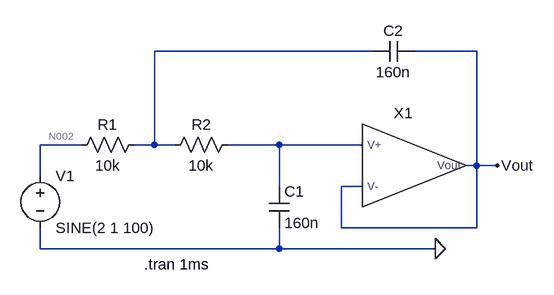
[diagram p0: schematic SecondOrder2.asc]
SecondOrder2.asc, the LTspice schematic file:
Version 4
SHEET 1 880 680
WIRE 224 -224 -112 -224
WIRE 384 -224 288 -224
WIRE -224 -80 -288 -80
WIRE -112 -80 -112 -224
WIRE -112 -80 -144 -80
WIRE -80 -80 -112 -80
WIRE 80 -80 0 -80
WIRE 208 -80 80 -80
WIRE 384 -48 384 -224
WIRE 384 -48 368 -48
WIRE 416 -48 384 -48
WIRE -288 -32 -288 -80
WIRE 80 -16 80 -80
WIRE 208 -16 176 -16
WIRE 176 48 176 -16
WIRE 384 48 384 -48
WIRE 384 48 176 48
WIRE -288 80 -288 48
WIRE 80 80 80 48
WIRE 80 80 -288 80
WIRE 320 80 80 80
FLAG 320 80 0
FLAG 416 -48 Vout
SYMBOL res -128 -96 R90
WINDOW 0 0 56 VBottom 2
WINDOW 3 32 56 VTop 2
SYMATTR InstName R1
SYMATTR Value 10k
SYMBOL cap 64 -16 R0
SYMATTR InstName C1
SYMATTR Value 160n
SYMBOL MY_IDEAL_opamp 272 -48 R0
SYMATTR InstName X1
SYMBOL voltage -288 -48 R0
WINDOW 123 0 0 Left 0
WINDOW 39 0 0 Left 0
SYMATTR InstName V1
SYMATTR Value SINE(2 1 100)
SYMBOL cap 288 -240 R90
WINDOW 0 0 32 VBottom 2
WINDOW 3 32 32 VTop 2
SYMATTR InstName C2
SYMATTR Value 160n
SYMBOL res 16 -96 R90
WINDOW 0 0 56 VBottom 2
WINDOW 3 32 56 VTop 2
SYMATTR InstName R2
SYMATTR Value 10k
TEXT -128 104 Left 2 !.tran 1ms

The netlist it stands for:
* SecondOrder2.asc
R1 N001 N002 10k
C1 N003 0 160n
XX1 N003 Vout Vout MY_IDEAL_opamp  ; pins V+ V- Vout
V1 N002 0 SINE(2 1 100)
C2 Vout N001 160n
R2 N003 N001 10k
.tran 1ms
.backanno
.end

* Results of the author's LTspice run, read from the files saved beside the schematic
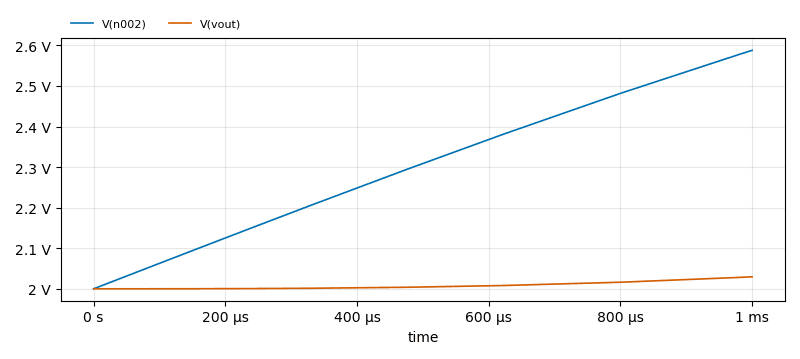
[diagram p1: Transient Analysis of SecondOrder2.asc, plotted from the saved traces]
* Transient Analysis, 1 run:
*   V(n002): min 2 V, max 2.588 V, average 2.304 V, rms 2.31 V, last 2.588 V
*   V(vout): min 2 V, max 2.03 V, average 2.008 V, rms 2.008 V, last 2.03 V